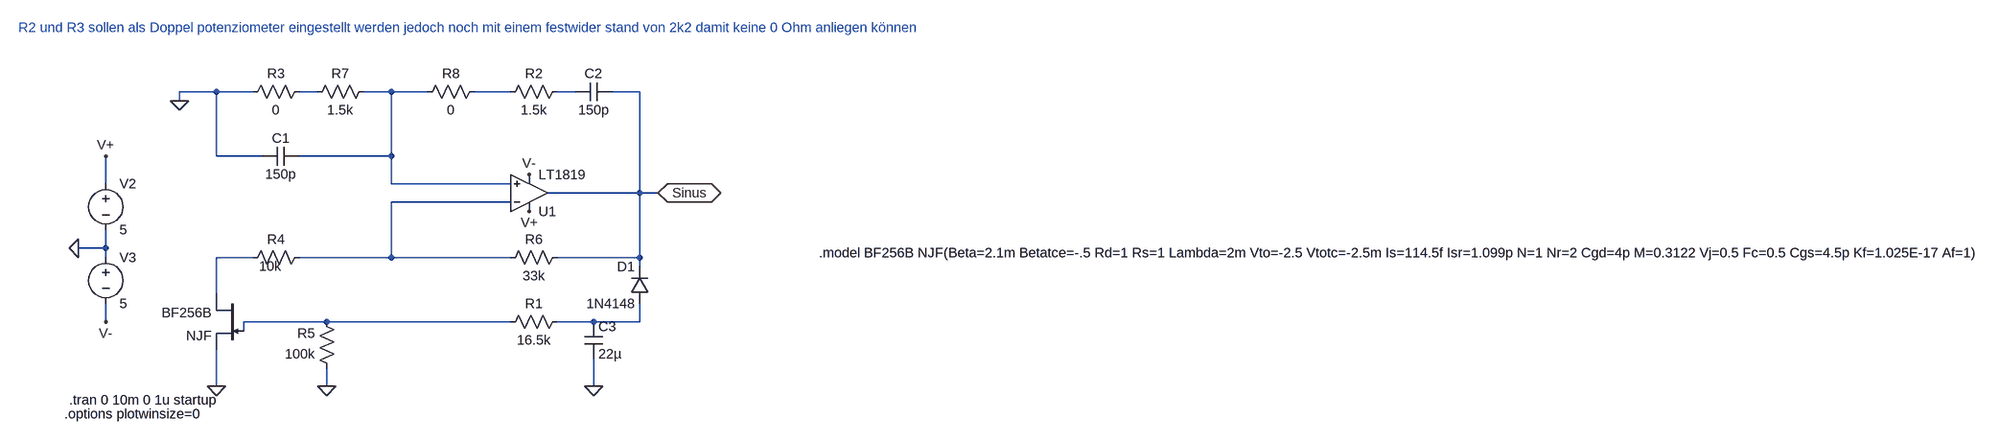
[diagram p0: schematic Wien_Robinson_Oszillator.asc]
Wien_Robinson_Oszillator.asc, the LTspice schematic file:
Version 4.1
SHEET 1 3124 680
WIRE 32 -176 -32 -176
WIRE 96 -176 32 -176
WIRE 208 -176 176 -176
WIRE 336 -176 288 -176
WIRE 400 -176 336 -176
WIRE 544 -176 480 -176
WIRE 656 -176 624 -176
WIRE 768 -176 720 -176
WIRE -32 -160 -32 -176
WIRE 32 -64 32 -176
WIRE 112 -64 32 -64
WIRE 336 -64 336 -176
WIRE 336 -64 176 -64
WIRE -160 -16 -160 -64
WIRE 336 -16 336 -64
WIRE 544 -16 336 -16
WIRE 768 0 768 -176
WIRE 768 0 608 0
WIRE 800 0 768 0
WIRE 544 16 336 16
WIRE -160 96 -160 64
WIRE -160 96 -208 96
WIRE -160 112 -160 96
WIRE 96 112 32 112
WIRE 336 112 336 16
WIRE 336 112 176 112
WIRE 544 112 336 112
WIRE 768 112 768 0
WIRE 768 112 624 112
WIRE 768 128 768 112
WIRE 32 176 32 112
WIRE -160 224 -160 192
WIRE 224 224 80 224
WIRE 544 224 224 224
WIRE 688 224 624 224
WIRE 768 224 768 192
WIRE 768 224 688 224
WIRE 80 240 80 224
WIRE 32 336 32 272
WIRE 224 336 224 304
WIRE 688 336 688 288
FLAG -160 -64 V+
FLAG -160 224 V-
FLAG 576 -32 V-
FLAG 576 32 V+
FLAG 32 336 0
FLAG 224 336 0
FLAG 688 336 0
FLAG -208 96 0
FLAG -32 -160 0
FLAG 800 0 Sinus
IOPIN 800 0 BiDir
SYMBOL res 640 208 R90
WINDOW 0 0 56 VBottom 2
WINDOW 3 32 56 VTop 2
SYMATTR InstName R1
SYMATTR Value 16.5k
SYMBOL cap 176 -80 R90
WINDOW 0 0 32 VBottom 2
WINDOW 3 32 32 VTop 2
SYMATTR InstName C1
SYMATTR Value 150p
SYMBOL voltage -160 -32 R0
WINDOW 123 0 0 Left 0
WINDOW 39 0 0 Left 0
SYMATTR InstName V2
SYMATTR Value 5
SYMBOL voltage -160 96 R0
WINDOW 123 0 0 Left 0
WINDOW 39 0 0 Left 0
SYMATTR InstName V3
SYMATTR Value 5
SYMBOL cap 720 -192 R90
WINDOW 0 0 32 VBottom 2
WINDOW 3 32 32 VTop 2
SYMATTR InstName C2
SYMATTR Value 150p
SYMBOL cap 672 224 R0
SYMATTR InstName C3
SYMATTR Value 22µ
SYMBOL res 640 -192 R90
WINDOW 0 0 56 VBottom 2
WINDOW 3 32 56 VTop 2
SYMATTR InstName R2
SYMATTR Value 1.5k
SYMBOL res 192 -192 R90
WINDOW 0 0 56 VBottom 2
WINDOW 3 32 56 VTop 2
SYMATTR InstName R3
SYMATTR Value 0
SYMBOL res 192 96 R90
WINDOW 0 0 56 VBottom 2
WINDOW 3 16 66 VTop 2
SYMATTR InstName R4
SYMATTR Value 10k
SYMBOL res 240 320 R180
WINDOW 0 36 76 Left 2
WINDOW 3 36 40 Left 2
SYMATTR InstName R5
SYMATTR Value 100k
SYMBOL diode 784 192 R180
WINDOW 0 24 64 Left 2
WINDOW 3 24 0 Left 2
SYMATTR InstName D1
SYMATTR Value 1N4148
SYMBOL res 640 96 R90
WINDOW 0 0 56 VBottom 2
WINDOW 3 32 56 VTop 2
SYMATTR InstName R6
SYMATTR Value 33k
SYMBOL res 304 -192 R90
WINDOW 0 0 56 VBottom 2
WINDOW 3 32 56 VTop 2
SYMATTR InstName R7
SYMATTR Value 1.5k
SYMBOL res 496 -192 R90
WINDOW 0 0 56 VBottom 2
WINDOW 3 32 56 VTop 2
SYMATTR InstName R8
SYMATTR Value 0
SYMBOL lib\\sym\\OpAmps\\LT1819 576 0 M180
SYMATTR InstName U1
SYMBOL lib\\sym\\njf 80 176 M0
SYMATTR InstName BF256B
TEXT -224 360 Left 2 !.tran 0 10m 0 1u startup
TEXT -312 -288 Left 2 ;R2 und R3 sollen als Doppel potenziometer eingestellt werden jedoch noch mit einem festwider stand von 2k2 damit keine 0 Ohm anliegen können
TEXT -232 384 Left 2 !.options plotwinsize=0
TEXT 1080 104 Left 2 !.model BF256B NJF(Beta=2.1m Betatce=-.5 Rd=1 Rs=1 Lambda=2m Vto=-2.5 Vtotc=-2.5m Is=114.5f Isr=1.099p N=1 Nr=2 Cgd=4p M=0.3122 Vj=0.5 Fc=0.5 Cgs=4.5p Kf=1.025E-17 Af=1)

The netlist it stands for:
* Wien_Robinson_Oszillator.asc
R1 N008 N007 16.5k
C1 N002 0 150p
V2 V+ 0 5
V3 0 V- 5
C2 Sinus N004 150p
C3 N008 0 22µ
R2 N004 N003 1.5k
R3 N001 0 0
R4 N005 N006 10k
R5 0 N007 100k
D1 N008 Sinus 1N4148
R6 Sinus N005 33k
R7 N002 N001 1.5k
R8 N003 N002 0
* U1: LT1819 (symbol lib\sym\OpAmps\LT1819 not available, pins judged from their places): In+=N002 In-=N005 V+=V+ V-=V- OUT=Sinus
J§BF256B N006 N007 0 NJF
.model D D
.lib standard.dio
.model NJF NJF
.model PJF PJF
.lib standard.jft
.tran 0 10m 0 1u startup
* R2 und R3 sollen als Doppel potenziometer eingestellt werden jedoch noch mit einem festwider stand von 2k2 damit keine 0 Ohm anliegen können
.options plotwinsize=0
.model BF256B NJF(Beta=2.1m Betatce=-.5 Rd=1 Rs=1 Lambda=2m Vto=-2.5 Vtotc=-2.5m Is=114.5f Isr=1.099p N=1 Nr=2 Cgd=4p M=0.3122 Vj=0.5 Fc=0.5 Cgs=4.5p Kf=1.025E-17 Af=1)
.backanno
.end